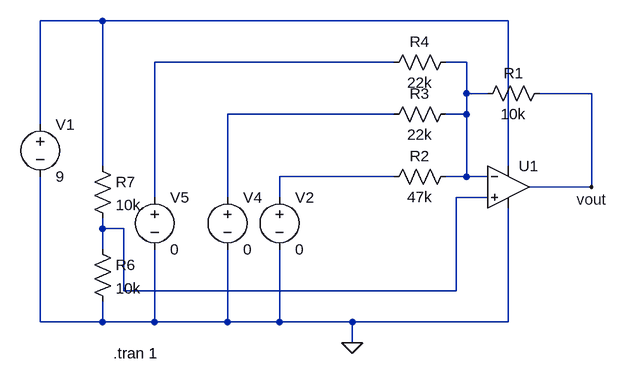
[diagram p0: schematic gatesum2.asc]
gatesum2.asc, the LTspice schematic file:
Version 4
SHEET 1 880 680
WIRE -208 -96 -304 -96
WIRE 416 -96 -208 -96
WIRE 240 -32 -128 -32
WIRE 352 -32 320 -32
WIRE 352 16 352 -32
WIRE 384 16 352 16
WIRE 544 16 464 16
WIRE 240 48 -16 48
WIRE 352 48 352 16
WIRE 352 48 320 48
WIRE -304 64 -304 -96
WIRE -208 128 -208 -96
WIRE 416 128 416 -96
WIRE 240 144 64 144
WIRE 352 144 352 48
WIRE 352 144 320 144
WIRE 384 144 352 144
WIRE 544 160 544 16
WIRE 544 160 448 160
WIRE -128 176 -128 -32
WIRE -16 176 -16 48
WIRE 64 176 64 144
WIRE 384 176 336 176
WIRE -208 224 -208 208
WIRE -176 224 -208 224
WIRE -208 256 -208 224
WIRE -176 320 -176 224
WIRE 336 320 336 176
WIRE 336 320 -176 320
WIRE -304 368 -304 144
WIRE -208 368 -208 336
WIRE -208 368 -304 368
WIRE -128 368 -128 256
WIRE -128 368 -208 368
WIRE -16 368 -16 256
WIRE -16 368 -128 368
WIRE 64 368 64 256
WIRE 64 368 -16 368
WIRE 176 368 64 368
WIRE 416 368 416 192
WIRE 416 368 176 368
WIRE 176 400 176 368
FLAG 176 400 0
FLAG 544 160 vout
SYMBOL voltage -304 48 R0
WINDOW 123 0 0 Left 2
WINDOW 39 0 0 Left 2
SYMATTR InstName V1
SYMATTR Value 9
SYMBOL voltage 64 160 R0
WINDOW 123 0 0 Left 2
WINDOW 39 0 0 Left 2
SYMATTR InstName V2
SYMATTR Value 0
SYMBOL Opamps\\UniversalOpamp2 416 160 R0
SYMATTR InstName U1
SYMBOL res 480 0 R90
WINDOW 0 0 56 VBottom 2
WINDOW 3 32 56 VTop 2
SYMATTR InstName R1
SYMATTR Value 10k
SYMBOL res 336 128 R90
WINDOW 0 0 56 VBottom 2
WINDOW 3 32 56 VTop 2
SYMATTR InstName R2
SYMATTR Value 47k
SYMBOL voltage -16 160 R0
WINDOW 123 0 0 Left 2
WINDOW 39 0 0 Left 2
SYMATTR InstName V4
SYMATTR Value 0
SYMBOL res 336 32 R90
WINDOW 0 0 56 VBottom 2
WINDOW 3 32 56 VTop 2
SYMATTR InstName R3
SYMATTR Value 22k
SYMBOL voltage -128 160 R0
WINDOW 123 0 0 Left 2
WINDOW 39 0 0 Left 2
SYMATTR InstName V5
SYMATTR Value 0
SYMBOL res 336 -48 R90
WINDOW 0 0 56 VBottom 2
WINDOW 3 32 56 VTop 2
SYMATTR InstName R4
SYMATTR Value 22k
SYMBOL res -224 240 R0
SYMATTR InstName R6
SYMATTR Value 10k
SYMBOL res -224 112 R0
SYMATTR InstName R7
SYMATTR Value 10k
TEXT -192 416 Left 2 !.tran 1

The netlist it stands for:
* gatesum2.asc
V1 N001 0 9
V2 N005 0 0
XU1 N006 N003 N001 0 vout level.2 Avol=1Meg GBW=10Meg Slew=10Meg ilimit=25m rail=0 Vos=0 phimargin=45 en=0 enk=0 in=0 ink=0 Rin=500Meg  ; pins IN+ IN- V+ V- OUT
R1 vout N003 10k
R2 N003 N005 47k
V4 N004 0 0
R3 N003 N004 22k
V5 N002 0 0
R4 N003 N002 22k
R6 N006 0 10k
R7 N001 N006 10k
.tran 1
.lib UniversalOpamps2.sub
.backanno
.end